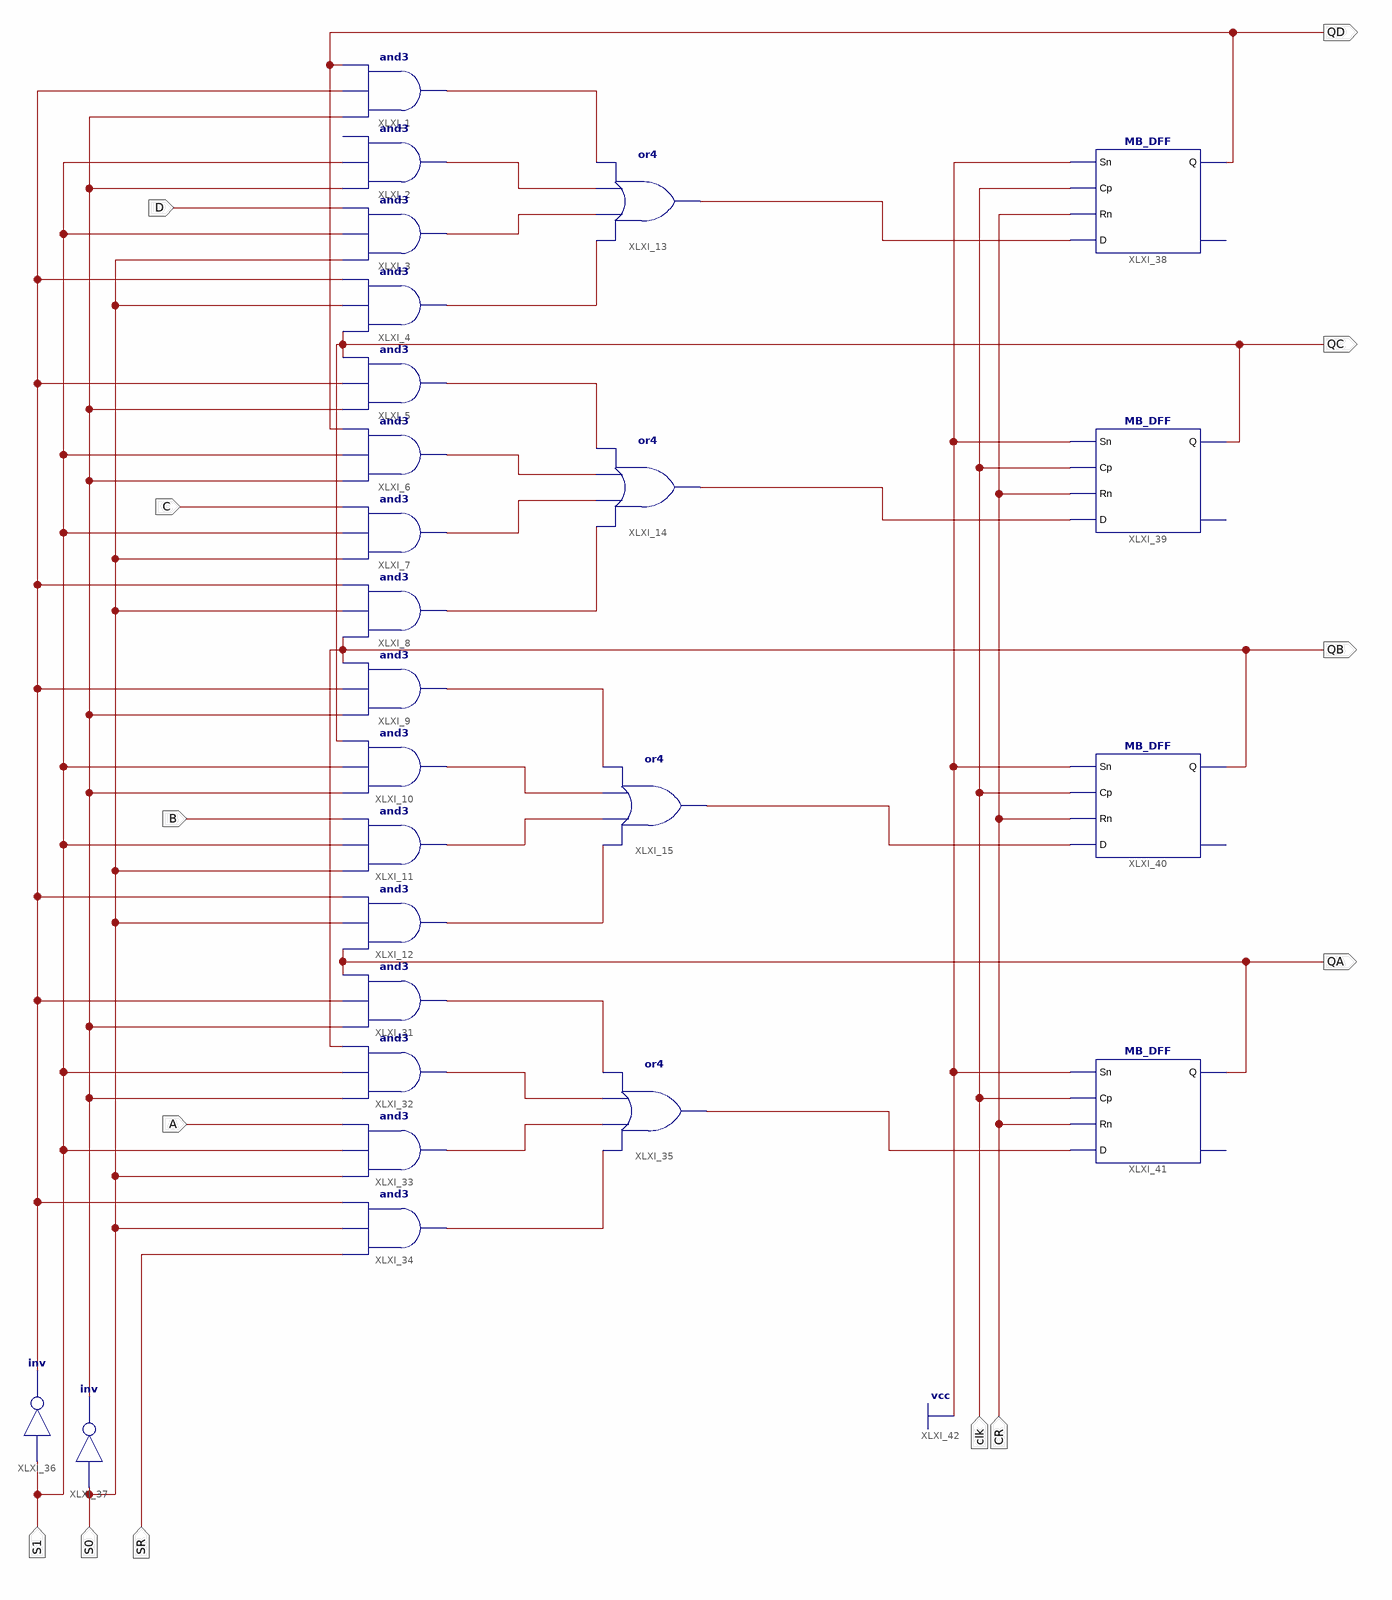
[diagram p0: schematic sheet 1]
// Xilinx ISE schematic DM74LS194.sch (kintex7) as structural Verilog: 26 symbols, 13 ports
module DM74LS194 (
  input  D,
  input  C,
  input  B,
  input  A,
  input  S1,
  input  S0,
  input  SR,
  input  CR,
  input  clk,
  output QC,
  output QD,
  output QB,
  output QA
);

  wire XLXN_7, XLXN_11, XLXN_25, XLXN_26, XLXN_27, XLXN_28, XLXN_29, XLXN_30, XLXN_32, XLXN_33, XLXN_34,
       XLXN_35, XLXN_36, XLXN_37, XLXN_38, XLXN_39, XLXN_40, XLXN_41, XLXN_51, XLXN_52, XLXN_53, XLXN_54;

  and XLXI_1 (XLXN_25, XLXN_11, XLXN_7, QD);
  and XLXI_2 (XLXN_26, XLXN_11, S1);  // open: I2
  and XLXI_3 (XLXN_27, S0, S1, D);
  and XLXI_4 (XLXN_28, QC, S0, XLXN_7);
  and XLXI_5 (XLXN_29, XLXN_11, XLXN_7, QC);
  and XLXI_6 (XLXN_30, XLXN_11, S1, QD);
  and XLXI_7 (XLXN_32, S0, S1, C);
  and XLXI_8 (XLXN_33, QB, S0, XLXN_7);
  and XLXI_9 (XLXN_37, XLXN_11, XLXN_7, QB);
  and XLXI_10 (XLXN_36, XLXN_11, S1, QC);
  and XLXI_11 (XLXN_35, S0, S1, B);
  and XLXI_12 (XLXN_34, QA, S0, XLXN_7);
  or XLXI_13 (XLXN_54, XLXN_28, XLXN_27, XLXN_26, XLXN_25);
  or XLXI_14 (XLXN_51, XLXN_33, XLXN_32, XLXN_30, XLXN_29);
  or XLXI_15 (XLXN_52, XLXN_34, XLXN_35, XLXN_36, XLXN_37);
  and XLXI_31 (XLXN_41, XLXN_11, XLXN_7, QA);
  and XLXI_32 (XLXN_40, XLXN_11, S1, QB);
  and XLXI_33 (XLXN_39, S0, S1, A);
  and XLXI_34 (XLXN_38, SR, S0, XLXN_7);
  or XLXI_35 (XLXN_53, XLXN_38, XLXN_39, XLXN_40, XLXN_41);
  not XLXI_36 (XLXN_7, S1);
  not XLXI_37 (XLXN_11, S0);
  MB_DFF XLXI_38 (.Sn(1'b1), .Cp(clk), .Rn(CR), .D(XLXN_54), .Q(QD));  // open: Qn
  MB_DFF XLXI_39 (.Sn(1'b1), .Cp(clk), .Rn(CR), .D(XLXN_51), .Q(QC));  // open: Qn
  MB_DFF XLXI_40 (.Sn(1'b1), .Cp(clk), .Rn(CR), .D(XLXN_52), .Q(QB));  // open: Qn
  MB_DFF XLXI_41 (.Sn(1'b1), .Cp(clk), .Rn(CR), .D(XLXN_53), .Q(QA));  // open: Qn
endmodule
